# EAGLE design kicker_controller (EAGLE 9.6.2)
AUTHOR: Mike Schmidt; GENERATION: pasta; TITLE: Kicker Controller; VERSION: 04

## Sheet 1 of 2: Logic Circuitry
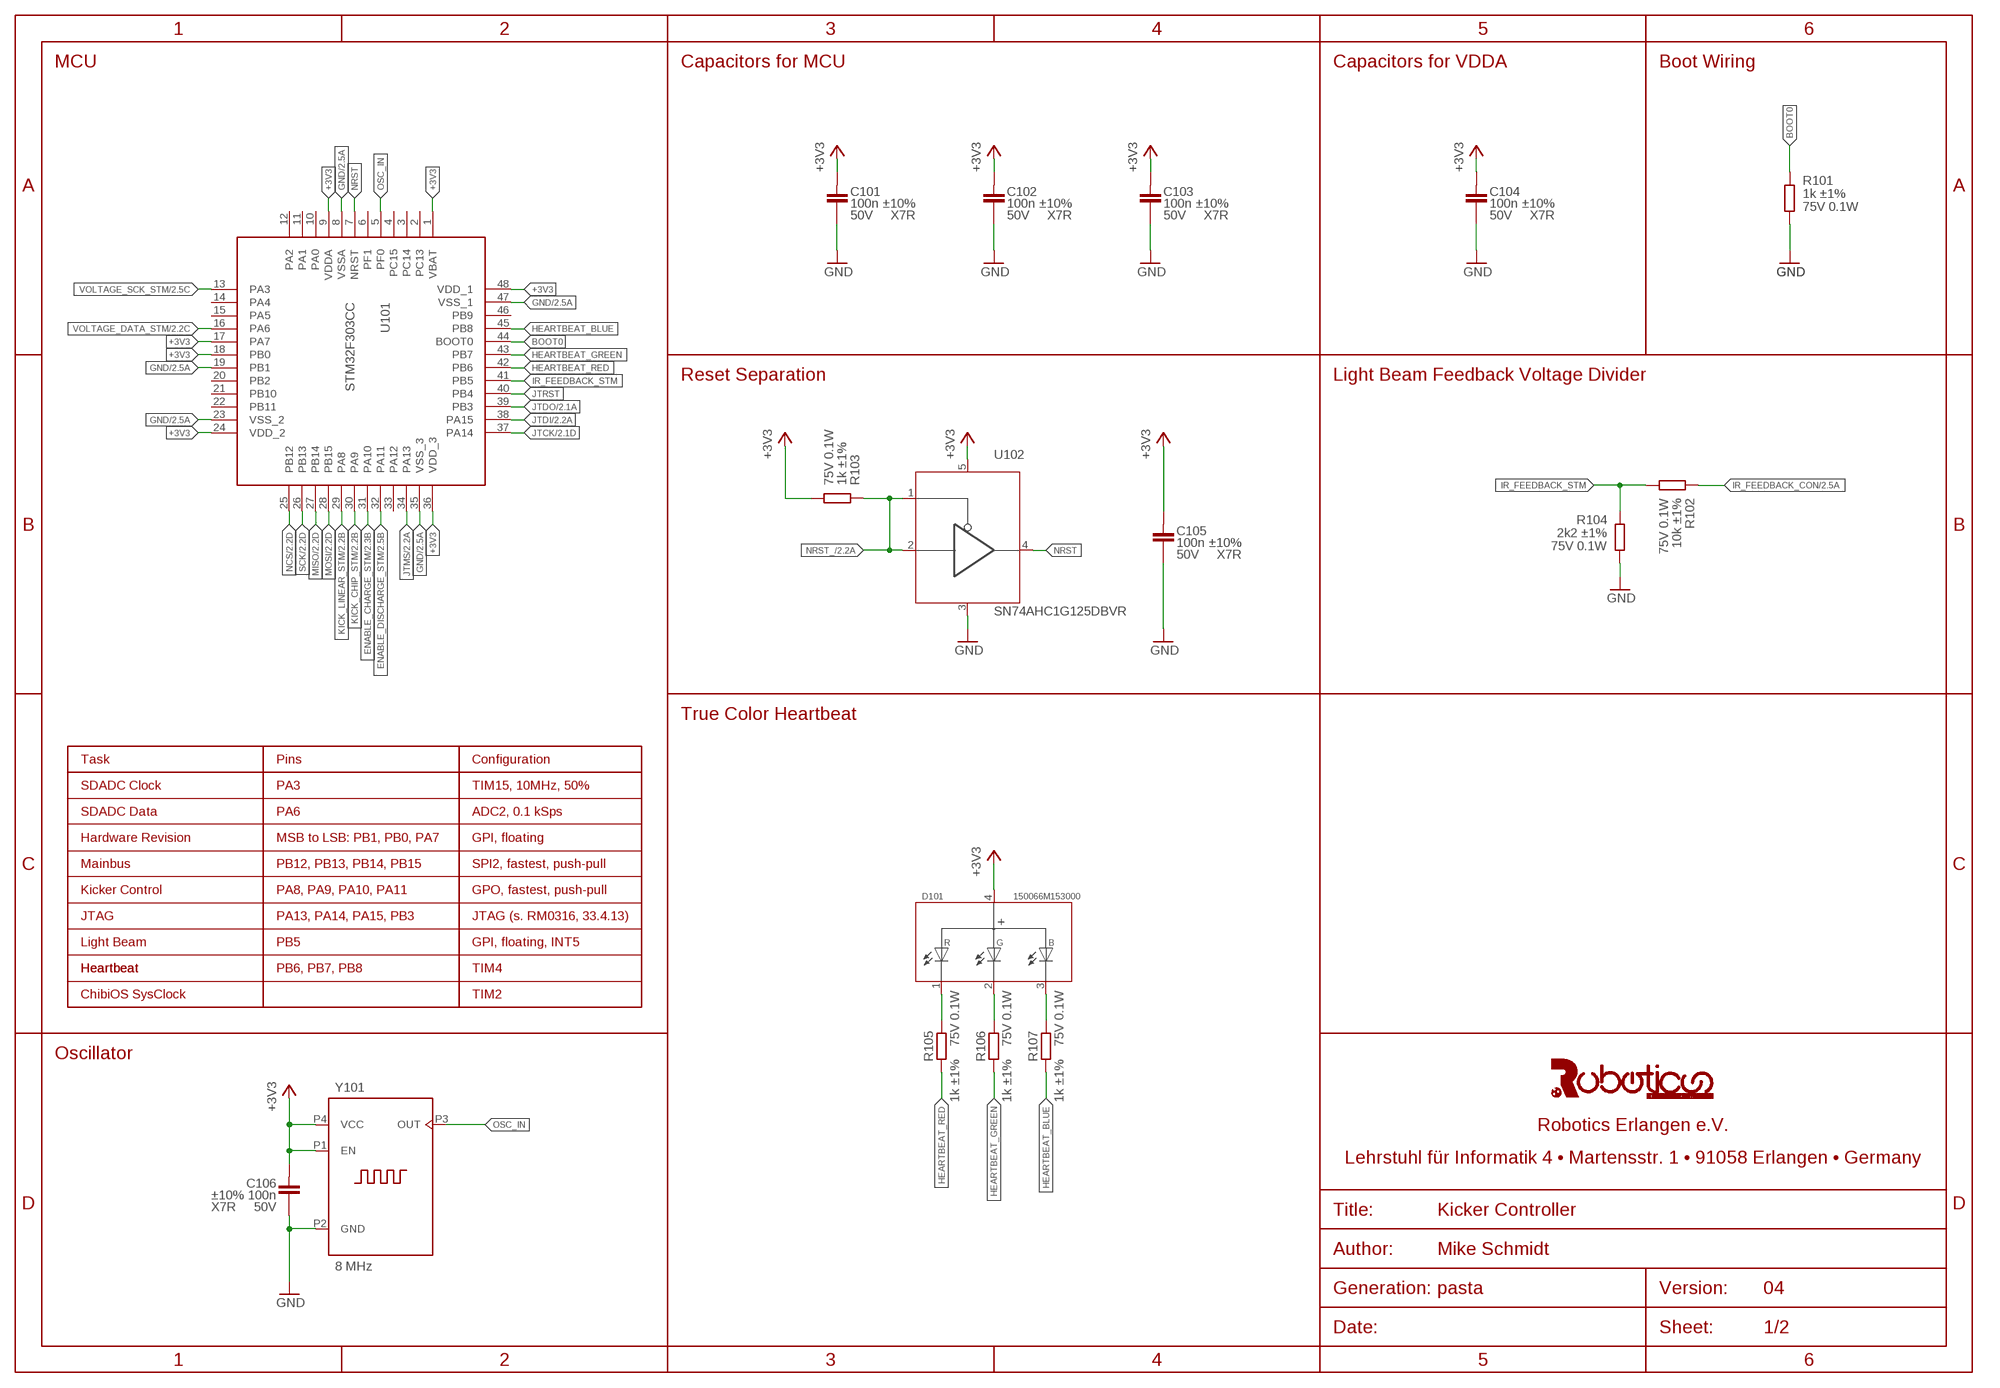
[diagram p0: schematic, sheet 1]

### Parts
C101  100n ±10% 50V X7R  C(100NF,50V,0603)  [C0603]
C102  100n ±10% 50V X7R  C(100NF,50V,0603)  [C0603]
C103  100n ±10% 50V X7R  C(100NF,50V,0603)  [C0603]
C104  100n ±10% 50V X7R  C(100NF,50V,0603)  [C0603]
C105  100n ±10% 50V X7R  C(100NF,50V,0603)  [C0603]
C106  100n ±10% 50V X7R  C(100NF,50V,0603)  [C0603]
D101  150066M153000  [WL-SFCX_0606]
R101  1k ±1% 75V 0.1W  R(1.0K,75V,0.1W,0603)  [R0603]
R102  10k ±1% 75V 0.1W  R(10K,75V,0.1W,0603)  [R0603]
R103  1k ±1% 75V 0.1W  R(1.0K,75V,0.1W,0603)  [R0603]
R104  2k2 ±1% 75V 0.1W  R(2.2K,75V,0.1W,0603)  [R0603]
R105  1k ±1% 75V 0.1W  R(1.0K,75V,0.1W,0603)  [R0603]
R106  1k ±1% 75V 0.1W  R(1.0K,75V,0.1W,0603)  [R0603]
R107  1k ±1% 75V 0.1W  R(1.0K,75V,0.1W,0603)  [R0603]
U101  STM32F303CC  [LQFP48]
U102  SN74AHC1G125DBVR  [SOT23-5]
Y101  8 MHz  830207192009  [830207192009]

### Nets
+3V3: C101.1 C102.1 C103.1 C104.1 C105.1 C106.1 D101.4 R103.1 U101.1(VBAT) U101.9(VDDA) U101.17(PA7) U101.18(PB0) U101.24(VDD_2) U101.36(VDD_3) U101.48(VDD_1) U102.5(VCC) Y101.P1(EN) Y101.P4(VCC) ; also sheet 2
BOOT0: R101.2 U101.44(BOOT0)
ENABLE_CHARGE_STM: U101.31(PA10) ; also sheet 2
ENABLE_DISCHARGE_STM: U101.32(PA11) ; also sheet 2
GND: C101.2 C102.2 C103.2 C104.2 C105.2 C106.2 R101.1 R104.1 U101.8(VSSA) U101.19(PB1) U101.23(VSS_2) U101.35(VSS_3) U101.47(VSS_1) U102.3(GND) Y101.P2(GND) ; also sheet 2
HEARTBEAT_BLUE: R107.2 U101.45(PB8)
HEARTBEAT_GREEN: R106.2 U101.43(PB7)
HEARTBEAT_RED: R105.2 U101.42(PB6)
IR_FEEDBACK_CON: R102.2 ; also sheet 2
IR_FEEDBACK_STM: R102.1 R104.2 U101.41(PB5)
JTCK: U101.37(PA14) ; also sheet 2
JTDI: U101.38(PA15) ; also sheet 2
JTDO: U101.39(PB3) ; also sheet 2
JTMS: U101.34(PA13) ; also sheet 2
JTRST: U101.40(PB4)
KICK_CHIP_STM: U101.30(PA9) ; also sheet 2
KICK_LINEAR_STM: U101.29(PA8) ; also sheet 2
MISO: U101.27(PB14) ; also sheet 2
MOSI: U101.28(PB15) ; also sheet 2
N$10: D101.1(R) R105.1
N$21: D101.2(G) R106.1
N$23: D101.3(B) R107.1
NCS: U101.25(PB12) ; also sheet 2
NRST: U101.7(NRST) U102.4(O)
NRST_: R103.2 U102.1(OE) U102.2(I) ; also sheet 2
OSC_IN: U101.5(PF0) Y101.P3(OUT)
SCK: U101.26(PB13) ; also sheet 2
VOLTAGE_DATA_STM: U101.16(PA6) ; also sheet 2
VOLTAGE_SCK_STM: U101.13(PA3) ; also sheet 2
Unconnected: U101.2(PC13) U101.3(PC14) U101.4(PC15) U101.6(PF1) U101.10(PA0) U101.11(PA1) U101.12(PA2) U101.14(PA4) U101.15(PA5) U101.20(PB2) U101.21(PB10) U101.22(PB11) U101.33(PA12) U101.46(PB9)

### Notes on the sheet
- MCU | Capacitors for MCU | Capacitors for VDDA | Boot Wiring
- Reset Separation | Light Beam Feedback Voltage Divider
- True Color Heartbeat
- Task | Pins | Configuration
- SDADC Clock | PA3 | TIM15, 10MHz, 50%
- SDADC Data | PA6 | ADC2, 0.1 kSps
- Hardware Revision | MSB to LSB: PB1, PB0, PA7 | GPI, floating
- Mainbus | PB12, PB13, PB14, PB15 | SPI2, fastest, push-pull
- Kicker Control | PA8, PA9, PA10, PA11 | GPO, fastest, push-pull
- JTAG | PA13, PA14, PA15, PB3 | JTAG (s. RM0316, 33.4.13)
- Light Beam | PB5 | GPI, floating, INT5
- Heartbeat | Heartbeat | PB6, PB7, PB8 | TIM4
- ChibiOS SysClock | TIM2
- Oscillator

## Sheet 2 of 2: Interface Circuitry
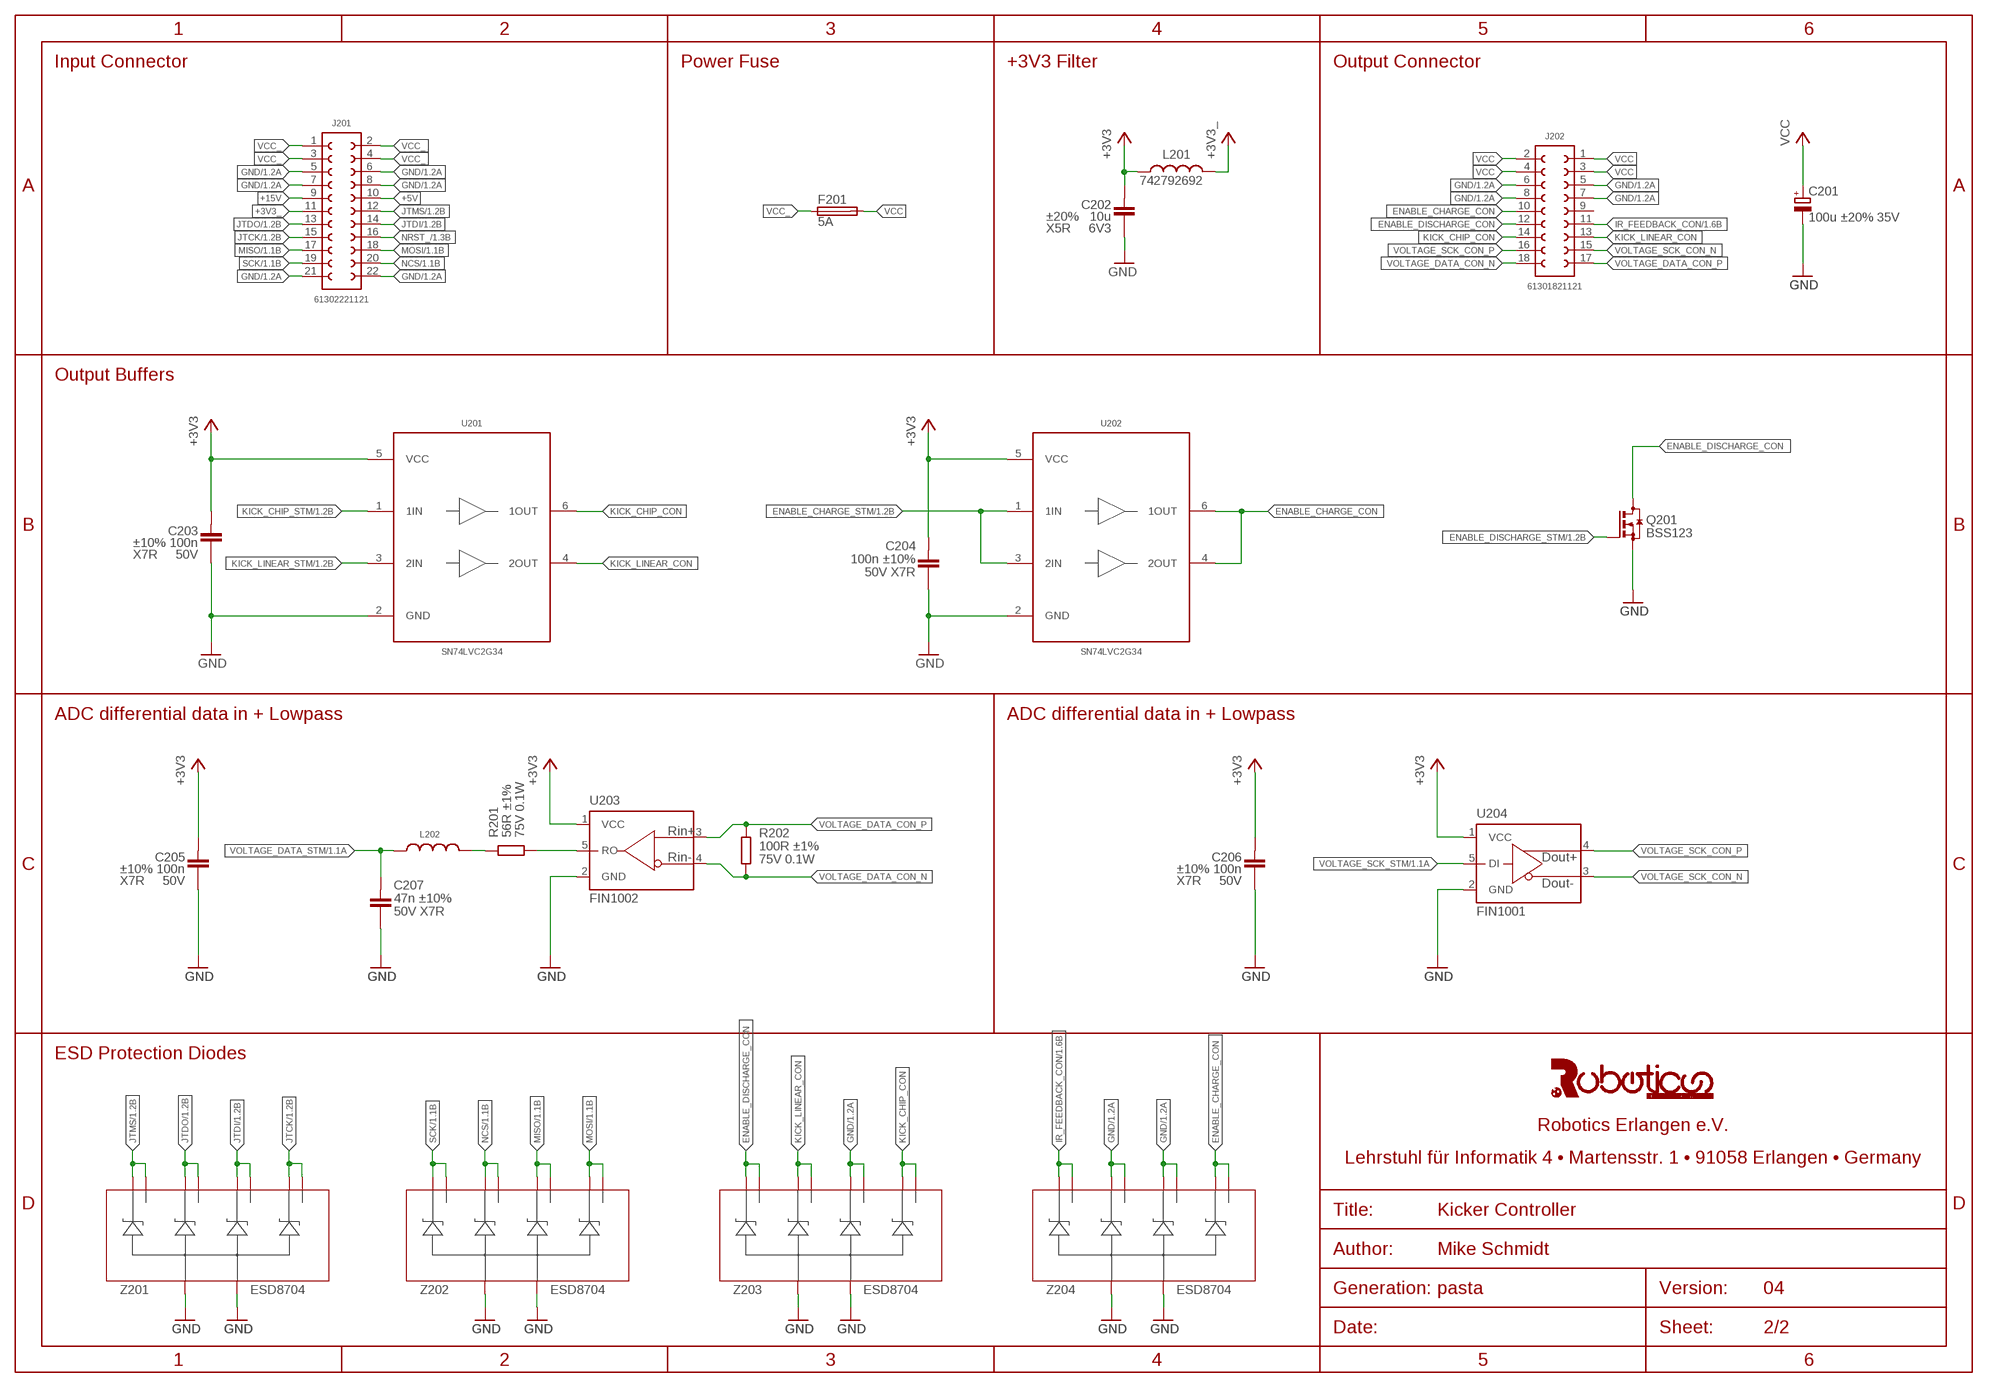
[diagram p1: schematic, sheet 2]

### Parts
C201  100u ±20% 35V  865080545012  [865080545012]
C202  10u ±20% 6V3 X5R  C(10UF,6.3V,0603)  [C0603]
C203  100n ±10% 50V X7R  C(100NF,50V,0603)  [C0603]
C204  100n ±10% 50V X7R  C(100NF,50V,0603)  [C0603]
C205  100n ±10% 50V X7R  C(100NF,50V,0603)  [C0603]
C206  100n ±10% 50V X7R  C(100NF,50V,0603)  [C0603]
C207  47n ±10% 50V X7R  C(47NF,50V,0603)  [C0603]
F201  5A  0157005.DRT  [157T]
J201  61302221121  [61302221121]
J202  61301821121  [61301821121]
L201  742792692  [WE-CBF_0603(W=2.6)]
L202  WE-GFH_4532_7447669212  [WE-GFH_4532]
Q201  BSS123  [SOT23]
R201  56R ±1% 75V 0.1W  R(56R,75V,0.1W,0603)  [R0603]
R202  100R ±1% 75V 0.1W  R(100R,75V,0.1W,0603)  [R0603]
U201  SN74LVC2G34  [SOT]
U202  SN74LVC2G34  [SOT]
U203  FIN1002  [SOT23-5]
U204  FIN1001  [SOT23-5]
Z201  ESD8704  [UDFN10]
Z202  ESD8704  [UDFN10]
Z203  ESD8704  [UDFN10]
Z204  ESD8704  [UDFN10]

### Nets
+3V3: C202.1 C203.1 C204.1 C205.1 C206.1 L201.2 U201.5(VCC) U202.5(VCC) U203.1(VCC) U204.1(VCC) ; also sheet 1
+3V3_: J201.11 L201.1
+5V: J201.10
+15V: J201.9
ENABLE_CHARGE_CON: J202.10 U202.4(2OUT) U202.6(1OUT) Z204.5(C4) Z204.6(D4)
ENABLE_CHARGE_STM: U202.1(1IN) U202.3(2IN) ; also sheet 1
ENABLE_DISCHARGE_CON: J202.12 Q201.3(D) Z203.1(C1) Z203.10(D1)
ENABLE_DISCHARGE_STM: Q201.1(G) ; also sheet 1
GND: C201.N(-) C202.2 C203.2 C204.2 C205.2 C206.2 C207.2 J201.5 J201.6 J201.7 J201.8 J201.21 J201.22 J202.5 J202.6 J202.7 J202.8 Q201.2(S) U201.2(GND) U202.2(GND) U203.2(GND) U204.2(GND) Z201.3(A) Z201.8(A) Z202.3(A) Z202.8(A) Z203.3(A) Z203.4(C3) Z203.7(D3) Z203.8(A) Z204.2(C2) Z204.3(A) Z204.4(C3) Z204.7(D3) Z204.8(A) Z204.9(D2) ; also sheet 1
IR_FEEDBACK_CON: J202.11 Z204.1(C1) Z204.10(D1) ; also sheet 1
JTCK: J201.15 Z201.5(C4) Z201.6(D4) ; also sheet 1
JTDI: J201.14 Z201.4(C3) Z201.7(D3) ; also sheet 1
JTDO: J201.13 Z201.2(C2) Z201.9(D2) ; also sheet 1
JTMS: J201.12 Z201.1(C1) Z201.10(D1) ; also sheet 1
KICK_CHIP_CON: J202.14 U201.6(1OUT) Z203.5(C4) Z203.6(D4)
KICK_CHIP_STM: U201.1(1IN) ; also sheet 1
KICK_LINEAR_CON: J202.13 U201.4(2OUT) Z203.2(C2) Z203.9(D2)
KICK_LINEAR_STM: U201.3(2IN) ; also sheet 1
MISO: J201.17 Z202.4(C3) Z202.7(D3) ; also sheet 1
MOSI: J201.18 Z202.5(C4) Z202.6(D4) ; also sheet 1
N$1: R201.1 U203.5(RO)
N$2: L202.2 R201.2
NCS: J201.20 Z202.2(C2) Z202.9(D2) ; also sheet 1
NRST_: J201.16 ; also sheet 1
SCK: J201.19 Z202.1(C1) Z202.10(D1) ; also sheet 1
VCC: C201.P(+) F201.2 J202.1 J202.2 J202.3 J202.4
VCC_: F201.1 J201.1 J201.2 J201.3 J201.4
VOLTAGE_DATA_CON_N: J202.18 R202.1 U203.4(RIN-)
VOLTAGE_DATA_CON_P: J202.17 R202.2 U203.3(RIN+)
VOLTAGE_DATA_STM: C207.1 L202.1 ; also sheet 1
VOLTAGE_SCK_CON_N: J202.15 U204.3(DOUT-)
VOLTAGE_SCK_CON_P: J202.16 U204.4(DOUT+)
VOLTAGE_SCK_STM: U204.5(DI) ; also sheet 1
Unconnected: J202.9

### Notes on the sheet
- Input Connector | Power Fuse | +3V3 Filter | Output Connector
- Output Buffers
- ADC differential data in + Lowpass | ADC differential data in + Lowpass
- ESD Protection Diodes

## Library data of the parts
C101-C106 C203-C206 = capacitors:C(*?): Robotics Erlangen Capacitor Library This library provides a list of predefined capacitors with the following features: It is guaranteed that the capacitor exists with the given value, voltage rating and package size If you choose the capacitor you need (e.g. 2u2 with at least 50V) the package will be automatically choosen The manufacturer's data is automatically added so that exactly that capacitor will be ordered The value of the capacitor will be automatically filled with the most relevant data To choose a capacitor, you need to think about the voltage it must be rated for acc. to your application. Use below table to get a minimum voltage rating for the capacitor, depending on the maximum voltage that will be applied to it in your application. Maximum Voltage Applied Notes Minimum Voltage Rating ≤ 3.3V ≥ 6V3 ≤ 5.0V ≥ 10V ≤ 16.8V ≥ 25V ≤ 33.6V Includes all signals that are at max. VCC ≥ 50V After you determined the minimum voltage rating of the capacitor, search for it in the database of this library and choose the first one, that has at least that rating. The library is primarily sorted by capacitance values. Never change the value of predefined capacitors! Note: If your project requires a very specific capacitor (e.g. low tolerance, high voltage or E-24 upwards), then choose any of the predefined empty devices C(0402), C(0603), C(0805), C(1206), C(1210), or C(1812). Always set the attributes MF, MPN and VALUE for custom capacitors!; CAPACITANCE: 100n; DIELECTRIC: X7R; LINE1: 100n ±10%; LINE2: 50V X7R; MF: Würth Elektronik; MPN: 885012206095; TOLERANCE: ±10%; VOLTAGE: 50V
C201 = kicker_controller:865080545012; MF: Würth Elektronik; MPN: 865080545012
C202 = capacitors:C(*?): Robotics Erlangen Capacitor Library This library provides a list of predefined capacitors with the following features: It is guaranteed that the capacitor exists with the given value, voltage rating and package size If you choose the capacitor you need (e.g. 2u2 with at least 50V) the package will be automatically choosen The manufacturer's data is automatically added so that exactly that capacitor will be ordered The value of the capacitor will be automatically filled with the most relevant data To choose a capacitor, you need to think about the voltage it must be rated for acc. to your application. Use below table to get a minimum voltage rating for the capacitor, depending on the maximum voltage that will be applied to it in your application. Maximum Voltage Applied Notes Minimum Voltage Rating ≤ 3.3V ≥ 6V3 ≤ 5.0V ≥ 10V ≤ 16.8V ≥ 25V ≤ 33.6V Includes all signals that are at max. VCC ≥ 50V After you determined the minimum voltage rating of the capacitor, search for it in the database of this library and choose the first one, that has at least that rating. The library is primarily sorted by capacitance values. Never change the value of predefined capacitors! Note: If your project requires a very specific capacitor (e.g. low tolerance, high voltage or E-24 upwards), then choose any of the predefined empty devices C(0402), C(0603), C(0805), C(1206), C(1210), or C(1812). Always set the attributes MF, MPN and VALUE for custom capacitors!; CAPACITANCE: 10u; DIELECTRIC: X5R; LINE1: 10u ±20%; LINE2: 6V3 X5R; MF: Würth Elektronik; MPN: 885012106006; TOLERANCE: ±20%; VOLTAGE: 6V3
C207 = capacitors:C(*?): Robotics Erlangen Capacitor Library This library provides a list of predefined capacitors with the following features: It is guaranteed that the capacitor exists with the given value, voltage rating and package size If you choose the capacitor you need (e.g. 2u2 with at least 50V) the package will be automatically choosen The manufacturer's data is automatically added so that exactly that capacitor will be ordered The value of the capacitor will be automatically filled with the most relevant data To choose a capacitor, you need to think about the voltage it must be rated for acc. to your application. Use below table to get a minimum voltage rating for the capacitor, depending on the maximum voltage that will be applied to it in your application. Maximum Voltage Applied Notes Minimum Voltage Rating ≤ 3.3V ≥ 6V3 ≤ 5.0V ≥ 10V ≤ 16.8V ≥ 25V ≤ 33.6V Includes all signals that are at max. VCC ≥ 50V After you determined the minimum voltage rating of the capacitor, search for it in the database of this library and choose the first one, that has at least that rating. The library is primarily sorted by capacitance values. Never change the value of predefined capacitors! Note: If your project requires a very specific capacitor (e.g. low tolerance, high voltage or E-24 upwards), then choose any of the predefined empty devices C(0402), C(0603), C(0805), C(1206), C(1210), or C(1812). Always set the attributes MF, MPN and VALUE for custom capacitors!; CAPACITANCE: 47n; DIELECTRIC: X7R; LINE1: 47n ±10%; LINE2: 50V X7R; MF: Würth Elektronik; MPN: 885012206093; TOLERANCE: ±10%; VOLTAGE: 50V
D101 = kicker_controller:150066M153000: WL-SFCD SMD Full-color Chip LED Diffused <http://katalog.we-online.de/media/images/v2/Family_WL-SFCD.jpg> Details see: http://katalog.we-online.de/en/led/WL-SFCD Created By Yingchun,Shan 2016 (C) Wurth Elektronik; MF: Würth Elektronik; MPN: 150066M153000
F201 = kicker_controller:0157*DRT: 157T Series - Standard Nano2® Fuse and Clip Assembly Description The 157T Series Fuse/Clip assembly is a small, square, Time-Lag, surface mount fuse that is assembled in surface mountable fuse clips. The unique time delay feature of this fuse design helps solve the problem of nuisance “opening” by accommodating inrush currents that normally cause a fast acting fuse to open. The fuse clip and pre-installed fuse combination can be automatically placed in PC Board in one efficient manufacturing operation. It permits quick and easy replacement of fuses without performing desoldering process, even in the field and without exposing the PC Board to detrimental effects of rework solder heat. Features Surface-Mountable, Time-Lag Fuse. Fully compatible with RoHS/Pb-Free solder alloys and higher temperature profiles associated with leadfree assembly Easily replaceable on PC Board (Field Replaceable) RoHS Compliant and Halogen-free Available in ratings of 0.375 ~ 5 Amperes Applications Instrumentations Base Stations Telecommunications Additional Information Datasheet <http://www.littelfuse.com/~/media/electronics/datasheets/fuses/littelfuse_fuse_157t_datasheet.pdf.pdf> Resources <http://www.littelfuse.com/products/fuse-blocks-fuseholders-and-fuse-accessories/fuse-clips/157t.aspx#TechnicalResources> Samples <http://www.littelfuse.com/products/fuse-blocks-fuseholders-and-fuse-accessories/fuse-clips/157t.aspx#ElectricalCharacteristics>; MF: Littelfuse; MOUSER: 576-0157005.DRT; MPN: 0157005.DRT
J201 = connectors:61302221121; MF: Würth Elektronik; MPN: 61302221121
J202 = connectors:61301821121; MF: Würth Elektronik; MPN: 61301821121
L201 = kicker_controller:742792: WE-CBF SMD EMI Suppression Ferrite Bead Characteristics Reliable Ni-Sn electrodes High rated current up to 6 A Operating temperature: –55 ºC to +125 ºC Applications Perfect as data lined filter and for uncoupling of distribution voltage Package name and Variant abbreviation: Package: Wide Band /High Speed: W=Width= 2.2 High Current: W=Width= 2.6 Variant abbreviation: WB = Wide Band HS=High Speed HC=High Current <https://katalog.we-online.de/media/images/v2/o14753v209%20Family_WE-CBF.jpg> Details see: http://katalog.we-online.de/en/pbs/WE-CBF Updated by Ella Wu 2019-01-02 2019 (C) Wurth Elektronik; MF: Würth Elektronik; MPN: 742792692
L202 = kicker_controller:WE-GFH_4532: SMD RF Choke WE-GFH - Wire wound ferrite - For higher currents -- HF-circuits like tuner, transponder etc. <http://katalog.we-online.de/media/images/v2/Family_WE-GFH.jpg> Details see: http://katalog.we-online.de/en/pbs/WE-GFH Updated by Dan Xu 2014-05-19 2014 (C) Wurth Elektronik; WE-NUMBER: 7447669212/120uH
Q201 = kicker_controller:BSS123: N-CHANNEL MOS FET
R101 R103 R105-R107 = resistors:R(*?): Robotics Erlangen Resistor Library This library provides a list of predefined resistors with the following features: It is guaranteed that the resistor exists with the given value, voltage rating and package size If you choose the resistor you need (e.g. 10k with at least 75V and 0.1W) the package will be automatically choosen The manufacturer's data is automatically added so that exactly that resistor will be ordered The value of the resistor will be automatically filled with the most relevant data To choose a resistor, you have to determine the maximum operating voltage and power dissipation that will be applied to that resistor in your design. With these two values you can choose the minimum package acc. to below table, which lists the maximum operating voltage and power dissipation for each package. Always try to use a package with a voltage rating of at least twice your max. operating voltage and always keep a little marging between your power dissipation and the maximum power dissipation of the package (although typically, resistors can be overloaded by a factor of five for a short time period, i.e. less than a second). Package Maximum Operating Voltage Maximum Power Dissipation 0402 ≤ 50V ≤ 62.5 mW 0603 ≤ 75V ≤ 100 mW 0805 ≤ 150V ≤ 125 mW 1206 ≤ 200V ≤ 250 mW 1210 ≤ 200V ≤ 500 mW 2512 ≤ 200V ≤ 1 W Note: If your project requires a very specific resistor (e.g. low tolerance, high voltage / power dissipation or E-24 upwards), then choose any of the predefined empty devices R(0402), R(0603), R(0805), R(1206), R(1210), or R(2512). Always set the attributes MF, MPN and VALUE for custom resistors! Never change the value of non-custom resistors!; LINE1: 1k ±1%; LINE2: 75V 0.1W; MF: YAGEO; MPN: RC0603FR-071KL; POWER: 0.1W; RESISTANCE: 1k; TOLERANCE: ±1%; VOLTAGE: 75V
R102 = resistors:R(*?): Robotics Erlangen Resistor Library This library provides a list of predefined resistors with the following features: It is guaranteed that the resistor exists with the given value, voltage rating and package size If you choose the resistor you need (e.g. 10k with at least 75V and 0.1W) the package will be automatically choosen The manufacturer's data is automatically added so that exactly that resistor will be ordered The value of the resistor will be automatically filled with the most relevant data To choose a resistor, you have to determine the maximum operating voltage and power dissipation that will be applied to that resistor in your design. With these two values you can choose the minimum package acc. to below table, which lists the maximum operating voltage and power dissipation for each package. Always try to use a package with a voltage rating of at least twice your max. operating voltage and always keep a little marging between your power dissipation and the maximum power dissipation of the package (although typically, resistors can be overloaded by a factor of five for a short time period, i.e. less than a second). Package Maximum Operating Voltage Maximum Power Dissipation 0402 ≤ 50V ≤ 62.5 mW 0603 ≤ 75V ≤ 100 mW 0805 ≤ 150V ≤ 125 mW 1206 ≤ 200V ≤ 250 mW 1210 ≤ 200V ≤ 500 mW 2512 ≤ 200V ≤ 1 W Note: If your project requires a very specific resistor (e.g. low tolerance, high voltage / power dissipation or E-24 upwards), then choose any of the predefined empty devices R(0402), R(0603), R(0805), R(1206), R(1210), or R(2512). Always set the attributes MF, MPN and VALUE for custom resistors! Never change the value of non-custom resistors!; LINE1: 10k ±1%; LINE2: 75V 0.1W; MF: YAGEO; MPN: RC0603FR-0710KL; POWER: 0.1W; RESISTANCE: 10k; TOLERANCE: ±1%; VOLTAGE: 75V
R104 = resistors:R(*?): Robotics Erlangen Resistor Library This library provides a list of predefined resistors with the following features: It is guaranteed that the resistor exists with the given value, voltage rating and package size If you choose the resistor you need (e.g. 10k with at least 75V and 0.1W) the package will be automatically choosen The manufacturer's data is automatically added so that exactly that resistor will be ordered The value of the resistor will be automatically filled with the most relevant data To choose a resistor, you have to determine the maximum operating voltage and power dissipation that will be applied to that resistor in your design. With these two values you can choose the minimum package acc. to below table, which lists the maximum operating voltage and power dissipation for each package. Always try to use a package with a voltage rating of at least twice your max. operating voltage and always keep a little marging between your power dissipation and the maximum power dissipation of the package (although typically, resistors can be overloaded by a factor of five for a short time period, i.e. less than a second). Package Maximum Operating Voltage Maximum Power Dissipation 0402 ≤ 50V ≤ 62.5 mW 0603 ≤ 75V ≤ 100 mW 0805 ≤ 150V ≤ 125 mW 1206 ≤ 200V ≤ 250 mW 1210 ≤ 200V ≤ 500 mW 2512 ≤ 200V ≤ 1 W Note: If your project requires a very specific resistor (e.g. low tolerance, high voltage / power dissipation or E-24 upwards), then choose any of the predefined empty devices R(0402), R(0603), R(0805), R(1206), R(1210), or R(2512). Always set the attributes MF, MPN and VALUE for custom resistors! Never change the value of non-custom resistors!; LINE1: 2k2 ±1%; LINE2: 75V 0.1W; MF: YAGEO; MPN: RC0603FR-072K2L; POWER: 0.1W; RESISTANCE: 2k2; TOLERANCE: ±1%; VOLTAGE: 75V
R201 = resistors:R(*?): Robotics Erlangen Resistor Library This library provides a list of predefined resistors with the following features: It is guaranteed that the resistor exists with the given value, voltage rating and package size If you choose the resistor you need (e.g. 10k with at least 75V and 0.1W) the package will be automatically choosen The manufacturer's data is automatically added so that exactly that resistor will be ordered The value of the resistor will be automatically filled with the most relevant data To choose a resistor, you have to determine the maximum operating voltage and power dissipation that will be applied to that resistor in your design. With these two values you can choose the minimum package acc. to below table, which lists the maximum operating voltage and power dissipation for each package. Always try to use a package with a voltage rating of at least twice your max. operating voltage and always keep a little marging between your power dissipation and the maximum power dissipation of the package (although typically, resistors can be overloaded by a factor of five for a short time period, i.e. less than a second). Package Maximum Operating Voltage Maximum Power Dissipation 0402 ≤ 50V ≤ 62.5 mW 0603 ≤ 75V ≤ 100 mW 0805 ≤ 150V ≤ 125 mW 1206 ≤ 200V ≤ 250 mW 1210 ≤ 200V ≤ 500 mW 2512 ≤ 200V ≤ 1 W Note: If your project requires a very specific resistor (e.g. low tolerance, high voltage / power dissipation or E-24 upwards), then choose any of the predefined empty devices R(0402), R(0603), R(0805), R(1206), R(1210), or R(2512). Always set the attributes MF, MPN and VALUE for custom resistors! Never change the value of non-custom resistors!; LINE1: 56R ±1%; LINE2: 75V 0.1W; MF: YAGEO; MPN: RC0603FR-0756RL; POWER: 0.1W; RESISTANCE: 56R; TOLERANCE: ±1%; VOLTAGE: 75V
R202 = resistors:R(*?): Robotics Erlangen Resistor Library This library provides a list of predefined resistors with the following features: It is guaranteed that the resistor exists with the given value, voltage rating and package size If you choose the resistor you need (e.g. 10k with at least 75V and 0.1W) the package will be automatically choosen The manufacturer's data is automatically added so that exactly that resistor will be ordered The value of the resistor will be automatically filled with the most relevant data To choose a resistor, you have to determine the maximum operating voltage and power dissipation that will be applied to that resistor in your design. With these two values you can choose the minimum package acc. to below table, which lists the maximum operating voltage and power dissipation for each package. Always try to use a package with a voltage rating of at least twice your max. operating voltage and always keep a little marging between your power dissipation and the maximum power dissipation of the package (although typically, resistors can be overloaded by a factor of five for a short time period, i.e. less than a second). Package Maximum Operating Voltage Maximum Power Dissipation 0402 ≤ 50V ≤ 62.5 mW 0603 ≤ 75V ≤ 100 mW 0805 ≤ 150V ≤ 125 mW 1206 ≤ 200V ≤ 250 mW 1210 ≤ 200V ≤ 500 mW 2512 ≤ 200V ≤ 1 W Note: If your project requires a very specific resistor (e.g. low tolerance, high voltage / power dissipation or E-24 upwards), then choose any of the predefined empty devices R(0402), R(0603), R(0805), R(1206), R(1210), or R(2512). Always set the attributes MF, MPN and VALUE for custom resistors! Never change the value of non-custom resistors!; LINE1: 100R ±1%; LINE2: 75V 0.1W; MF: YAGEO; MPN: RC0603FR-07100RL; POWER: 0.1W; RESISTANCE: 100R; TOLERANCE: ±1%; VOLTAGE: 75V
U101 = kicker_controller:STM32F303CC: Cortex M4 Microcontroller; MF: STMicroelectronics; MOUSER: 511-STM32F303CCT6; MPN: STM32F303CCT6
U102 = kicker_controller:SN74AHC1G125DBV; MF: Texas Instruments; MOUSER: 595-SN74AHC1G125DBVR; MPN: SN74AHC1G125DBVR
U201 U202 = kicker_controller:SN74LVC2G34: 1. Features: Available in the Texas Instruments NanoFreeTM Package Supports 5.5 V VCC Operation Inputs Accept Voltages to 5.5 V Maximum tpd of 4.1 ns at 3.3 V Low Power Consumption, 10 µA Maximum ICC ±24 mA Output Drive at 3.3 V Typical VOLP (Output Ground Bounce) <0.8 V at VCC = 3.3 V, TA = 25 °C Typical VOHV (Output VOH Undershoot) >2 V at VCC = 3.3 V, TA = 25 °C Ioff Supports Live Insertion, Partial-Power-Down Mode, and Back-Drive Protection Can Be Used as a Down Translator to Translate Inputs From a Maximum of 5.5 V Down to the VCC Level Latch-Up Performance Exceeds 100 mA Per JESD 78, Class II ESD Protection Exceeds JESD 22 2000 V Human Body Model (A114-A) 200 V Machine Model (A115-A) 1000 V Charged-Device Model (C101) 2. Applications AV Receivers Audio Docks: Portable Blu-ray Players and Home Theaters DVD Recorders and Players Embedded PCs MP3 Players and Recorders (Portable Audio) Personal Digital Assistent (PDA) Power: Telecom/Server AC/DC Supply: Single Controller: Analog and Digital Solid-State Drive (SSD): Client and Enterprise TV: LCD/Digital and High-Definition (HDTV) Tablets: Enterprise Video Analytics: Servers Wireless Headsets, Keyboards, and Mice 3. Description The SN74LVC2G34 device is a dual buffer gate designed for 1.65 V to 5.5 V VCC operation. The SN74LVC2G34 device performs the Boolean function Y = A in positive logic. NanoFree package technology is a major breakthrough in IC packaging concepts, using the die as the package. This device is fully specified for partial-power-down applications using Ioff. The Ioff circuitry disables the outputs, preventing damaging current backflow through the device when it is powered down.; MF: Texas Instruments; MOUSER: 595-SN74LVC2G34DRLR; MPN: SN74LVC2G34
U203 = kicker_controller:FIN1002: 3.3V LVDS 1-Bit High Speed Differential Receiver; MOUSER-NR: 512-FIN1002M5X
U204 = kicker_controller:FIN1001: 3.3V LVDS 1-Bit High Speed Differential Driver; MOUSER-NR: 512-FIN1001M5X
Y101 = kicker_controller:83020*09; MF: Würth Elektronik; MPN: 830207192009
Z201-Z204 = kicker_controller:ESD8704; MF: ON Semiconductor; MOUSER: 863-ESD8704MUTAG; MPN: ESD8704MUTAG

## Net classes
0 default: clearance 0.2 mm

## Board
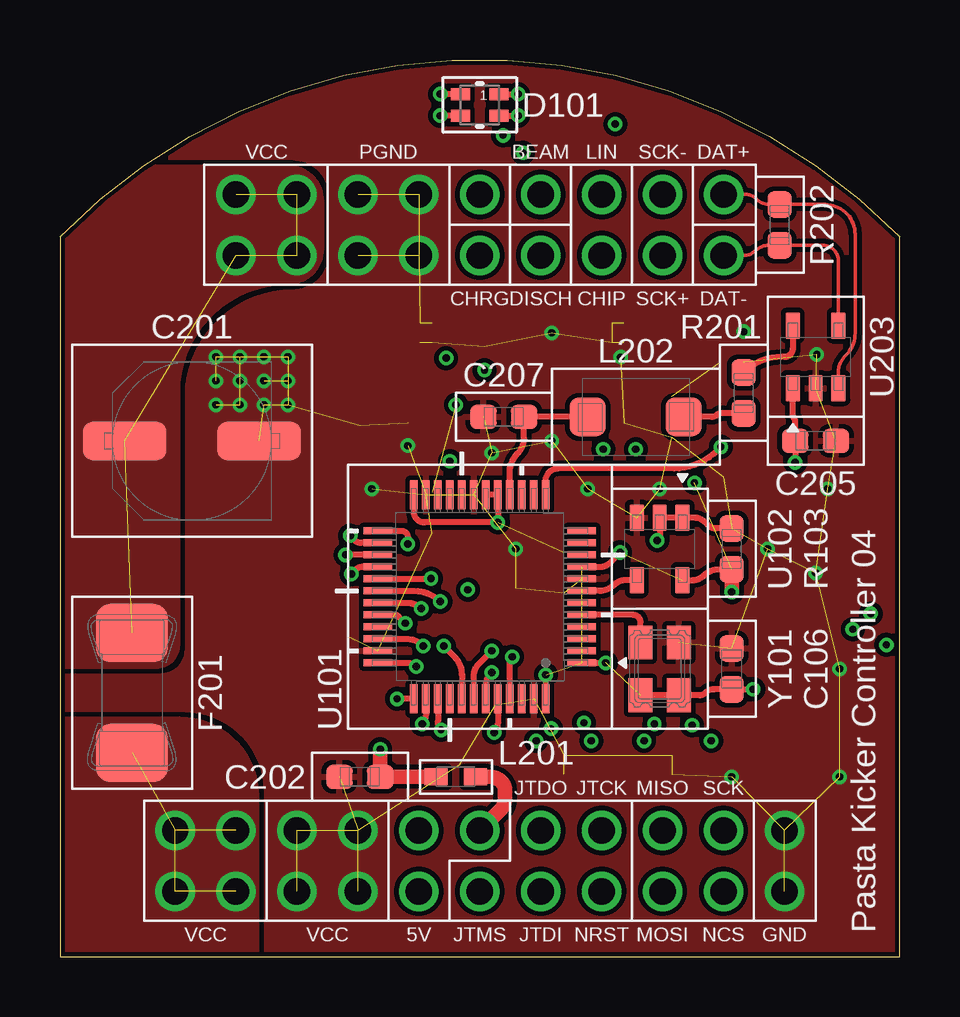
[diagram p2: board, top side]
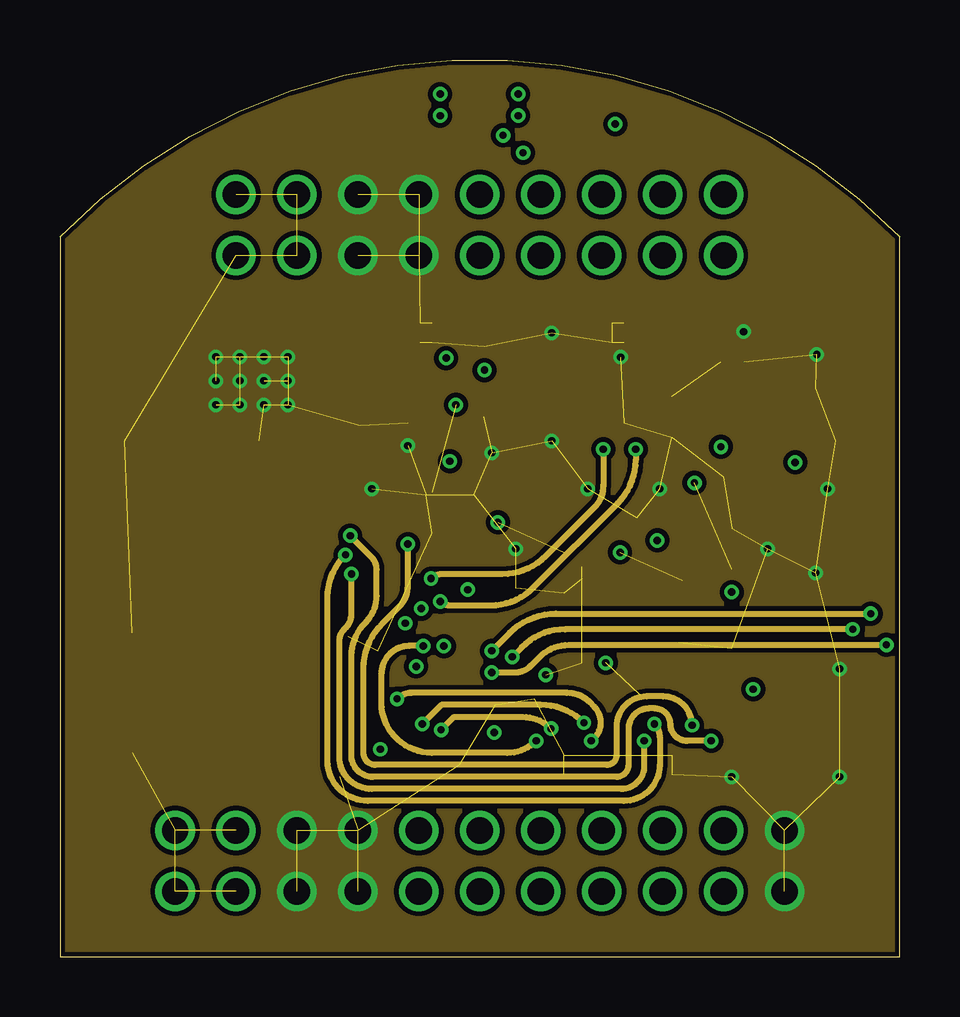
[diagram p3: board, inner layer Route2]
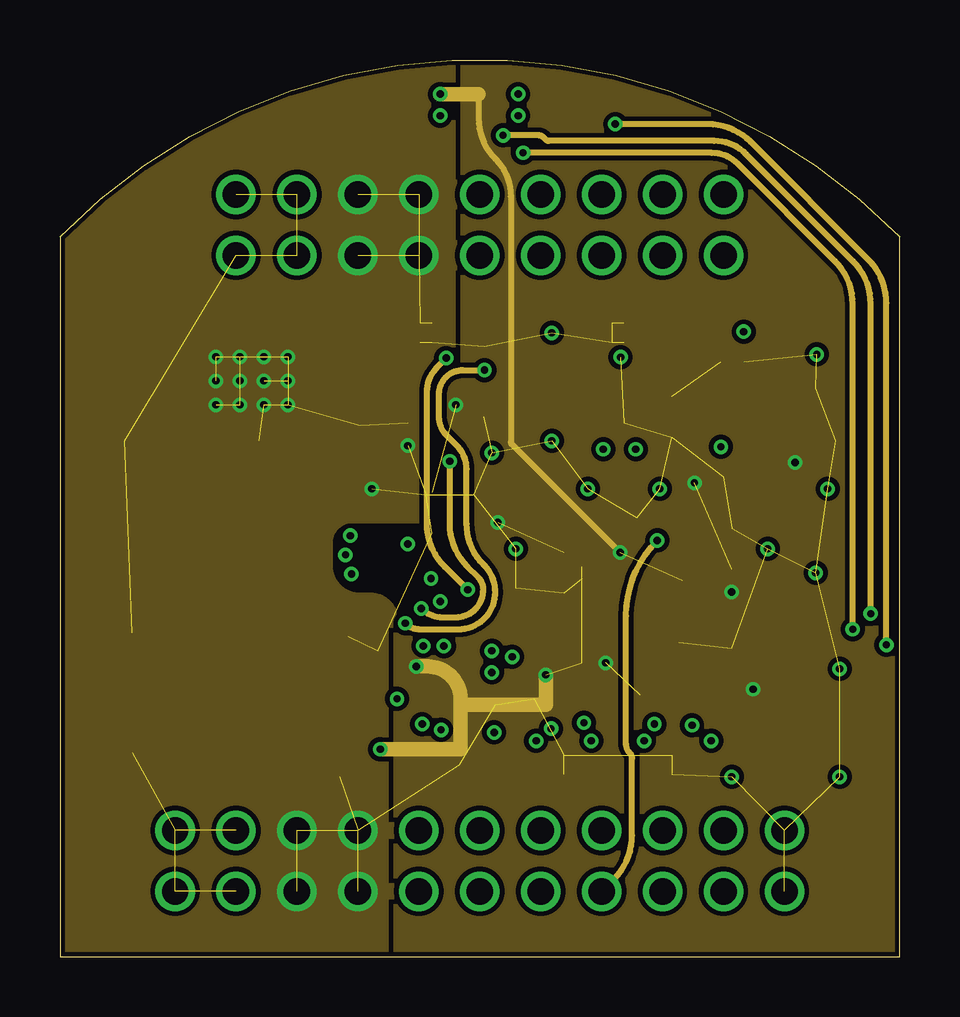
[diagram p4: board, inner layer Route15]
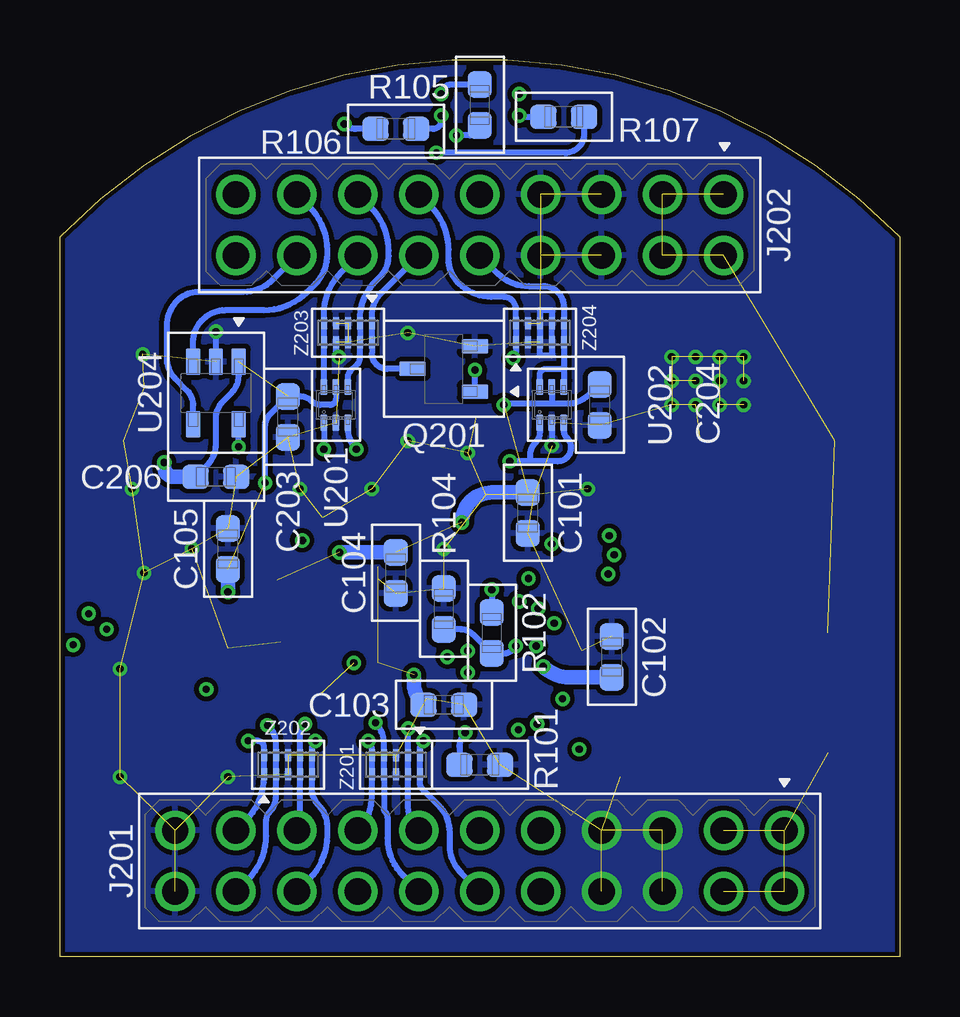
[diagram p5: board, bottom side, seen from below]

Size 35 x 37.37 mm. Coordinates in mm from the lower left corner, seen from the top.
Outline: 0,0 35,0 35,30 arc92 0,30 0,0
Copper layers (1+2*15+16): Top 0.035mm / dielectric 0.175mm / Route2 0.035mm / dielectric 1.13mm / Route15 0.035mm / dielectric 0.175mm / Bottom 0.035mm
Design rules "35u Robotics DRU No. 3 (6mil, 4 Layer, 0.3mm Drill)": minimum track width 6mil, minimum drill 0.3mm, track to track 6mil, track to pad 6mil, pad to pad 6mil, via to via 6mil, smd to smd 0mil, copper to edge 0.2mm, drill to drill 6mil, minimum pad ring 0.15mm, minimum via ring 0.15mm, stop-mask expansion 0.05mm, vias tented up to drill 0.45mm, thermal gap 0.2mm

### Footprints (pad centres in the part's own frame; a part is rotated, then mirrored left to right if it is on the bottom)
C0603 = smd 1.1 x 1: 1 -0.85,0; 2 0.85,0
865080545012 = smd 1.6 x 3.5: N 0,2.8; P 0,-2.8
WL-SFCX_0606 = smd 0.8 x 0.5: 1 0.8,0.45; 2 0.8,-0.45; 3 -0.8,-0.45; 4 -0.8,0.45
157T = smd 2.4 x 3: 1 -2.5,0; 2 2.5,0
61302221121 = drill 1.1: 1 -12.7,-1.27; 2 -12.7,1.27; 3 -10.16,-1.27; 4 -10.16,1.27; 5 -7.62,-1.27; 6 -7.62,1.27; 7 -5.08,-1.27; 8 -5.08,1.27; 9 -2.54,-1.27; 10 -2.54,1.27; 11 0,-1.27; 12 0,1.27; 13 2.54,-1.27; 14 2.54,1.27; 15 5.08,-1.27; 16 5.08,1.27; 17 7.62,-1.27; 18 7.62,1.27; 19 10.16,-1.27; 20 10.16,1.27; 21 12.7,-1.27; 22 12.7,1.27
61301821121 = drill 1.1: 1 -10.16,-1.27; 2 -10.16,1.27; 3 -7.62,-1.27; 4 -7.62,1.27; 5 -5.08,-1.27; 6 -5.08,1.27; 7 -2.54,-1.27; 8 -2.54,1.27; 9 0,-1.27; 10 0,1.27; 11 2.54,-1.27; 12 2.54,1.27; 13 5.08,-1.27; 14 5.08,1.27; 15 7.62,-1.27; 16 7.62,1.27; 17 10.16,-1.27; 18 10.16,1.27
WE-CBF_0603(W=2.6) = smd 0.95 x 0.7: 1 -0.825,0; 2 0.825,0
WE-GFH_4532 = smd 1.5 x 1.6: 1 -2,0; 2 2,0
SOT23 = smd 0.6 x 1.1: 1 -0.95,-1.3; 2 0.95,-1.3; 3 0,1.3
R0603 = smd 1.1 x 1: 1 -0.85,0; 2 0.85,0
LQFP48 = smd 1.2 x 0.3: 1 -4.25,2.75; 2 -4.25,2.25; 3 -4.25,1.75; 4 -4.25,1.25; 5 -4.25,0.75; 6 -4.25,0.25; 7 -4.25,-0.25; 8 -4.25,-0.75; 9 -4.25,-1.25; 10 -4.25,-1.75; 11 -4.25,-2.25; 12 -4.25,-2.75; 25 4.25,-2.75; 26 4.25,-2.25; 27 4.25,-1.75; 28 4.25,-1.25; 29 4.25,-0.75; 30 4.25,-0.25; 31 4.25,0.25; 32 4.25,0.75; 33 4.25,1.25; 34 4.25,1.75; 35 4.25,2.25; 36 4.25,2.75 | smd 0.3 x 1.2: 13 -2.75,-4.25; 14 -2.25,-4.25; 15 -1.75,-4.25; 16 -1.25,-4.25; 17 -0.75,-4.25; 18 -0.25,-4.25; 19 0.25,-4.25; 20 0.75,-4.25; 21 1.25,-4.25; 22 1.75,-4.25; 23 2.25,-4.25; 24 2.75,-4.25; 37 2.75,4.25; 38 2.25,4.25; 39 1.75,4.25; 40 1.25,4.25; 41 0.75,4.25; 42 0.25,4.25; 43 -0.25,4.25; 44 -0.75,4.25; 45 -1.25,4.25; 46 -1.75,4.25; 47 -2.25,4.25; 48 -2.75,4.25
SOT23-5 = smd 1.1 x 0.6: 1 -1.3,0.95; 2 -1.3,0; 3 -1.3,-0.95; 4 1.3,-0.95; 5 1.3,0.95
SOT = smd 0.67 x 0.3: 1 -0.74,0.5; 2 -0.74,0; 3 -0.74,-0.5; 4 0.74,-0.5; 5 0.74,0; 6 0.74,0.5
830207192009 = smd 1.4 x 1: P1 -1.1,-0.8; P2 1.1,-0.8; P3 1.1,0.8; P4 -1.1,0.8
UDFN10 = smd 0.25 x 0.5: 1 1,0.4; 2 0.5,0.4; 3 0,0.4; 4 -0.5,0.4; 5 -1,0.4; 6 -1,-0.4; 7 -0.5,-0.4; 8 0,-0.4; 9 0.5,-0.4; 10 1,-0.4

### Placement (x,y rotation side)
C101  15.5,18.5 270 bottom
C102  12,12.5 90 bottom
C103  19,10.5 0 bottom
C104  21,16 270 bottom
C105  28,17 90 bottom
C106  28,12 90 top
C201  5.5,21.5 270 top
C202  12.5,7.5 180 top
C203  25.5,22.5 270 bottom
C204  12.5,23 270 bottom
C205  31.5,21.5 0 top
C206  28.5,20 0 bottom
C207  18.5,22.5 180 top
D101  17.5,35.5 0 top
F201  3,11 90 top
J201  17.5,4 180 bottom
J202  17.5,30.5 180 bottom
L201  16.5,7.5 180 top
L202  24,22.5 0 top
Q201  19,24.5 90 bottom
R101  17.5,8 180 bottom
R102  17,13.5 90 bottom
R103  28,17 90 top
R104  19,14.5 270 bottom
R105  17.5,35.5 270 bottom
R106  21,34.5 180 bottom
R107  14,35 0 bottom
R201  28.5,23.5 270 top
R202  30,30.5 90 top
U101  17.5,15 180 top
U102  25,17 270 top
U201  23.5,23 90 bottom
U202  14.5,23 90 bottom
U203  31.5,25 90 top
U204  28.5,23.5 270 bottom
Y101  25,12 90 top
Z201  21,8 0 bottom
Z202  25.5,8 180 bottom
Z203  23,26 0 bottom
Z204  15,26 180 bottom

### Tracks (layer width: path | path; a pad name or v marks a point on that pad's centre or on a via)
+3V3  (via drill 0.3)  (8 unrouted)
  Top 0.254: v30.65,20.6 C205.1 30.65,22.33 arc45 30.6,22.45 arc-45 30.55,22.57 U203.1 | U102.5 26.37,15.7 arc45 26.85,15.9 arc-45 27.45,16.15 C105.1 | Y101.P4 Y101.P1 26.66,10.9 arc45 26.9,11 arc-45 27.26,11.15 C106.1 v28.9,11.15 | U101.1 v22.75,12.25 | U101.9 22.54,16.25 arc45 22.9,16.4 v23.35,16.85 | U101.48 v20.25,11.75 | D101.4 v15.85,35.95 | U101.18 U101.17 v18.25,18.1 15.2,18.1 arc-90 14.75,18.55 U101.24 | v14.85,12.1 arc45 14.49,12.25 U101.36
  Top 0.61: L201.2 C202.1 v13.35,8.65 | C105.1 v28,15.2
  Route15 0.254: 17.45,35.95 17.45,34.94 arc45 18.15,33.25 arc-45 18.8,31.68 18.8,21.45 arc45 18.84,21.36 v23.35,16.85
  Route15 0.61: v13.35,8.65 16.7,8.65 16.7,10.5 | 16.7,10.5 20.25,10.5 v20.25,11.75 | 16.7,10.5 16.7,10.75 arc90 15.35,12.1 v14.85,12.1 | v15.85,35.95 17.45,35.95
  Bottom 0.254: C204.1 arc-45 12.59,23.82 13.03,23.37 arc45 13.8,23.05 14.5,23.05 | U201.5 23.5,23.25 arc90 23.75,23 24.14,23 arc45 24.5,23.15 arc-45 24.98,23.35 C203.1 26.23,22.62 arc-45 26.45,22.09 v26.45,19.75 | C206.1 28.85,20.5 arc-45 28.5,21.35 28.5,22.43 arc45 28.2,23.15 27.83,23.52 arc-45 27.55,24.2 U204.1 | U202.5 14.5,23.05 | 14.5,23.05 16.38,23.05 arc45 v16.5,23
  Bottom 0.61: v23.35,16.85 C104.1 | v30.65,20.6 30.65,20.4 arc-90 30.25,20 C206.1 | v18.25,18.1 arc90 17,19.35 C101.1 | v28,15.2 C105.1 | v14.85,12.1 arc-45 13.76,11.65 C102.1 | v20.25,11.75 20.25,11.47 arc-45 C103.1
  pour Route15: 14,-1 36,-1 36,31 28,39 16.8,39 16.8,24.25 16,23.45 16,22 16.8,21.2 16.8,16.8 14,14
+3V3_
  Top 0.61: L201.1 17.91,7.5 arc-45 18.41,7.29 arc-45 18.55,6.95 18.55,6.55 arc-45 18.39,6.16 J201.11
BOOT0  (via drill 0.3)
  Top 0.254: U101.44 18.25,9.71 arc-45 v18.1,9.35
  Bottom 0.254: v18.1,9.35 arc-45 18.35,8.75 R101.2
ENABLE_CHARGE_CON
  Bottom 0.254: J202.10 16.76,28.49 arc-45 15.45,27.95 14.85,27.95 arc90 14,27.1 Z204.6 Z204.5 14,24.5 | 14,24.5 U202.4 | U202.6 15,24.25 arc90 14.75,24.5 14,24.5
ENABLE_CHARGE_STM  (via drill 0.3)
  Top 0.254: U101.31 14.5,14.75 arc-45 v15.07,14.52
  Route15 0.254: v15.07,14.52 arc45 15.95,14.15 16.5,14.15 arc90 17.65,15.3 arc45 17.44,15.81 16.99,16.26 arc-45 16.25,18.05 v16.25,20.65
  Bottom 0.254: U202.3 14,21.96 arc-45 13.85,21.6 13.84,21.59 arc45 13.7,21.25 13.7,21.2 arc90 14.25,20.65 15.4,20.65 | U202.1 15,21.84 arc45 15.17,21.43 15.2,21.4 arc-45 15.4,20.92 15.4,20.65 | 15.4,20.65 v16.25,20.65
ENABLE_DISCHARGE_CON
  Bottom 0.254: J202.12 21.6,27.67 arc-45 22,26.7 Z203.1 Z203.10 22,25.15 arc-90 21.35,24.5 Q201.3
ENABLE_DISCHARGE_STM  (via drill 0.3)
  Top 0.254: v14.4,13.9 14.12,14.18 arc45 13.95,14.25 U101.32
  Route15 0.254: v17.7,24.45 16.8,24.45 arc90 15.8,23.45 15.8,22.5 arc45 16.12,21.73 16.55,21.3 arc-45 16.95,20.33 16.95,18.04 arc45 17.65,16.35 17.69,16.31 arc-45 18.15,15.2 arc-90 16.6,13.65 15,13.65 arc-45 v14.4,13.9
  Bottom 0.254: Q201.1 v17.7,24.45
GND  (via drill 0.3)  (73 unrouted)
  Bottom 0.254: U202.2 v14.5,21.3 | U204.2 v28.5,26.05 | Z203.7 23.5,25.3 arc-45 v23.37,24.99 | Z204.4 Z204.7 14.5,26.95 15,26.95 Z204.8 Z204.3 15,25.05 14.5,25.05 Z204.4
  other vias: 6.5,25 7.5,25 8.5,25 9.5,25 9.5,24 8.5,24 7.5,24 6.5,24 6.5,23 7.5,23 8.5,23 9.5,23 19,17 32.5,7.5 31.5,16 13,19.5 20.5,26 20.5,21.5 18,21 22,19.5 25,19.5 32,19.5 29.5,17 32.5,12 28,7.5 31.55,25.1
  pour Route2 (no thermals): 8.8,0 8.8,7 13.6,7 13.6,0
  pour Top (rank 6): -1,-1 36,-1 36,30 27.5,38.5 7.5,38.5 -1,30
  pour Route2 (rank 6, no thermals): -1,-1 36,-1 36,30 27.5,38.5 7.5,38.5 -1,30
  pour Bottom (rank 6): -1,-1 36,-1 36,30 27.5,38.5 7.5,38.5 -1,30
  pour Route2 (no thermals): 8.8,0 8.8,6.6 arc46 7.6,9.45 arc-45 5,15.5 5,23.3 arc-38 5.55,24.9 arc-53 6.5,25.35 9.65,25.35 arc-90 11.4,23.6 11.4,15 arc31 12.5,11 arc-31 13.6,7 13.6,0
  pour Route2 (no thermals): 15.5,33 12,33 arc90 11.5,32.5 11.5,29 arc-90 10,27.5 9.5,27.5 arc64 5.5,25 arc27 5.24,23.86 arc90 7.1,22 10,22 arc90 16,28 16,32.5 arc90
  pour Top (no thermals): 8.5,1.5 31.5,1.5 31.5,6.5 8.5,6.5
  pour Bottom (no thermals): 8.5,1.5 13.5,1.5 13.5,6.5 8.5,6.5
  pour Top (no thermals): 6,20 11,20 11,23 6,23
  pour Top (rank 6, no thermals): 11,28 16,28 16,33 11,33
  pour Route15 (rank 6, no thermals): -1,-1 14,-1 14,14 arc90 12.95,15.05 12.5,15.05 arc-90 11.25,16.3 11.25,17.25 arc-90 12.2,18.2 16.8,18.2 16.8,39 7,39 -1,31
HEARTBEAT_BLUE  (via drill 0.3)
  Top 0.254: U101.45 18.75,12.26 arc-45 v18.85,12.5
  Route2 0.254: v33.05,13.65 21.05,13.65 arc45 19.26,12.91 v18.85,12.5
  Route15 0.254: v33.05,13.65 33.05,27.2 arc45 32.31,28.99 28.25,33.05 arc45 27.16,33.5 v19.32,33.5 arc-45 v19.31,33.51
  Bottom 0.254: R107.2 13.15,34.3 arc90 13.95,33.5 v19.3,33.5 arc90 v19.31,33.51
HEARTBEAT_GREEN  (via drill 0.3)
  Top 0.254: U101.43 17.75,11.25 arc-45 v18,11.85
  Route2 0.254: v18,11.85 18.95,11.85 arc45 19.63,12.13 20,12.5 arc-45 21.21,13 v34.45,13
  Route15 0.254: v34.45,13 34.45,27.25 arc45 33.71,29.04 28.79,33.96 arc45 27,34.7 v23.15,34.7
  Bottom 0.254: R106.2 22.67,34.5 arc45 v23.15,34.7
HEARTBEAT_RED  (via drill 0.3)
  Top 0.254: U101.42 17.25,11.7 arc-45 17.46,12.21 v18,12.75
  Route2 0.254: v18,12.75 18.76,13.51 arc-45 20.67,14.3 v33.8,14.3
  Route15 0.254: v33.8,14.3 33.8,27.2 arc45 33.06,28.99 28.6,33.45 arc45 27.27,34 20.37,34 arc-45 20.25,34.05 20.13,34.16 arc45 19.98,34.23 v18.47,34.23
  Bottom 0.254: R105.2 arc90 17.92,34.23 v18.47,34.23
IR_FEEDBACK_CON  (via drill 0.3)
  Route15 0.254: v16.1,24.95 15.76,24.61 arc45 15.3,23.5 15.3,18.05 arc45 16.04,16.26 v17,15.3
  Bottom 0.254: J202.11 19.54,31.27 arc45 18.8,29.48 18.8,29.1 arc-45 18.38,28.08 18.34,28.04 arc-45 17.03,27.5 16.5,27.5 arc90 16,27 Z204.10 Z204.1 16,25.19 arc45 v16.1,24.95 | v17,15.3 R102.2
IR_FEEDBACK_STM  (via drill 0.3)
  Top 0.254: v16,12.95 16.43,12.52 arc-45 16.75,11.75 U101.41
  Bottom 0.254: v16,12.95 16.19,12.76 arc45 16.45,12.65 R102.1 17.79,13.44 arc-45 18.3,13.65 R104.2
JTCK  (via drill 0.3)
  Top 0.254: U101.37 v14.05,10.75
  Route2 0.254: v22.15,9 22.3,9.15 arc45 22.55,9.75 arc45 22.27,10.43 22.1,10.6 arc45 21.13,11 14.65,11 arc45 v14.05,10.75
  Bottom 0.254: J201.15 arc-45 22,6.67 Z201.6 Z201.5 22,8.64 arc-45 v22.15,9
JTDI  (via drill 0.3)
  Top 0.254: U101.38 15.25,10.06 arc-45 v15.1,9.7
  Route2 0.254: v15.1,9.7 15.9,10.5 20.05,10.5 arc-45 v21.84,9.76 | v21.84,9.76
  Bottom 0.254: J201.14 20.71,3.4 arc45 21.35,4.95 21.35,5.81 arc-45 21.45,6.05 arc45 21.5,6.17 Z201.7 Z201.4 21.5,8.92 arc-45 v21.84,9.76
JTDO  (via drill 0.3)
  Top 0.254: U101.39 15.75,9.8 arc45 v15.89,9.46
  Route2 0.254: v15.89,9.46 16.43,10 19.29,10 arc-45 v20.47,9.51
  Bottom 0.254: J201.13 arc45 20.5,6.38 Z201.9 Z201.2 20.5,9.44 arc45 v20.47,9.51
JTMS  (via drill 0.3)
  Top 0.254: U101.34 14.44,13.25 arc-45 v15.15,12.96
  Route2 0.254: v19.85,9 arc-45 18.64,8.5 15.5,8.5 arc-90 13.4,10.6 13.4,11.8 arc-90 14.55,12.96 v15.15,12.96
  Bottom 0.254: J201.12 18.28,3.51 arc45 18.75,4.65 18.75,5.21 arc-45 19.2,6.3 19.89,6.99 arc45 20,7.25 Z201.10 Z201.1 20,8.64 arc45 v19.85,9
KICK_CHIP_CON
  Bottom 0.254: U201.6 Z203.6 Z203.5 24,26.76 arc45 23.26,28.55 J202.14
KICK_CHIP_STM  (via drill 0.3)
  Top 0.254: U101.30 14.79,15.25 arc-45 v15.86,14.81
  Route2 0.254: v24,21.15 24,20.7 arc-45 23.26,18.91 19.74,15.39 arc-45 17.95,14.65 16.23,14.65 arc-45 v15.86,14.81
  Bottom 0.254: U201.1 v24,21.15
KICK_LINEAR_CON
  Bottom 0.254: J202.13 22.04,31.23 arc45 21.3,29.44 21.3,29.2 arc45 21.65,28.35 21.8,28.2 arc-45 22.5,26.51 Z203.2 Z203.9 22.5,24.94 arc45 22.6,24.7 22.9,24.4 arc-45 23,24.16 U201.4
KICK_LINEAR_STM  (via drill 0.3)
  Top 0.254: U101.29 15.43,15.75 arc45 v15.47,15.77
  Route2 0.254: v22.65,21.15 22.65,19.66 arc-45 22.26,18.71 20.24,16.69 arc-45 18.45,15.95 15.92,15.95 arc45 v15.47,15.77
  Bottom 0.254: U201.3 23,22 arc-45 v22.65,21.15
MISO  (via drill 0.3)
  Top 0.254: U101.27 v11.9,16.75
  Route2 0.254: v24.78,9.7 arc-45 25,9.17 25,8 arc-90 23.5,6.5 12.84,6.5 arc-90 11.15,8.19 11.15,14.95 arc-45 v11.89,16.74 v11.9,16.75
  Bottom 0.254: J201.17 arc-45 25,5.56 Z202.4 Z202.7 25,9.17 arc45 v24.78,9.7
MOSI  (via drill 0.3)
  Top 0.254: v12.15,15.95 12.34,16.14 arc-45 12.6,16.25 U101.28
  Route2 0.254: v24.35,9 24.35,7.95 arc-90 23.4,7 12.99,7 arc-90 11.65,8.34 11.65,13.17 arc-45 11.85,13.65 11.93,13.73 arc45 12.15,14.26 v12.15,15.95
  Bottom 0.254: J201.18 24.59,3.26 arc-45 23.85,5.05 23.85,5.46 arc-45 24.2,6.3 arc45 24.5,7.02 Z202.5 Z202.6 24.5,8.64 arc45 v24.35,9
N$1
  Top 0.254: U203.5 30.55,25.35 arc-90 30.2,25 30.07,25 arc45 R201.1
N$2
  Top 0.254: R201.2 27.52,22.65 arc45 27.4,22.6 arc-45 27.16,22.5 L202.2
N$10  (via drill 0.3)
  Top 0.254: D101.1 v19.1,35.95
  Bottom 0.254: v19.1,35.95 arc90 18.7,36.35 R105.1
N$21  (via drill 0.3)
  Top 0.254: D101.2 v19.1,35.05
  Bottom 0.254: v19.1,35.05 19.1,34.85 arc90 19.45,34.5 R106.1
N$23  (via drill 0.3)
  Top 0.254: D101.3 v15.85,35.05
  Bottom 0.254: v15.85,35.05 arc-45 15.73,35 R107.1
NCS  (via drill 0.3)
  Top 0.254: U101.25 14.25,17.75 arc-90 14.5,17.5 v14.5,17.2
  Route2 0.254: v14.5,17.2 14.5,15.45 arc-45 14.15,14.6 13.44,13.89 arc45 12.65,11.98 12.65,8.5 arc90 13.15,8 22.8,8 arc90 23.2,8.4 23.2,9.6 arc-90 24.45,10.85 25.15,10.85 arc-90 v26.35,9.65
  Bottom 0.254: J201.20 27.14,3.25 arc-45 26.4,5.04 26.4,5.69 arc45 26.25,6.05 arc-45 26,6.65 Z202.2 Z202.9 26,8.95 arc-45 26.25,9.55 v26.35,9.65
NRST
  Top 0.254: U102.4 23.58,15.7 arc45 23.1,15.5 arc-45 22.5,15.25 U101.7
NRST_  (via drill 0.3)
  Top 0.254: v24.9,17.35 arc90 25,17.45 U102.2 U102.1 26.45,18.3 arc-45 26.88,18.12 27,18 arc45 27.36,17.85 R103.2
  Route15 0.254: J201.16 23.11,3.26 arc45 23.85,5.05 23.85,8.26 arc45 23.75,8.5 arc-45 23.6,8.86 23.6,14.21 arc-45 v24.9,17.35
OSC_IN
  Top 0.254: Y101.P3 24.2,13.95 arc90 23.9,14.25 U101.5
SCK  (via drill 0.3)
  Top 0.254: U101.26 12.55,17.25 arc-45 12.29,17.36 v12.1,17.55
  Route2 0.254: v27.15,9 26.15,9 arc-90 25.45,9.7 arc90 24.8,10.35 24.55,10.35 arc90 23.7,9.5 23.7,8 arc-90 23.2,7.5 13.05,7.5 arc-90 12.15,8.4 12.15,12.5 arc-45 12.75,13.95 arc45 13.2,15.04 13.2,16.15 arc45 12.99,16.66 v12.1,17.55
  Bottom 0.254: J201.19 27.24,5.69 arc-45 26.5,7.48 Z202.1 Z202.10 26.5,8.75 arc-90 26.75,9 v27.15,9
VCC  (5 unrouted)
  pour Top (no thermals): 0,12 4,12 arc90 5,13 5,23.5 arc-90 9.5,28 arc90 11,29.5 11,31.5 arc90 9.5,33 3,33 arc90 0,30
VCC_  (4 unrouted)
  pour Top (no thermals): 0,0 0,10 5,10 arc-90 8.3,6.7 8.3,0
VOLTAGE_DATA_CON_N
  Top 0.152: J202.18 28.54,29.23 arc45 28.95,29.4 arc-45 29.55,29.65 R202.1 31.8,29.65 arc-90 32.45,29 U203.4
VOLTAGE_DATA_CON_P
  Top 0.152: J202.17 28.59,31.77 arc-45 29,31.6 arc45 29.6,31.35 R202.2 31.9,31.35 arc-90 33.15,30.1 33.15,26 arc-45 32.76,25.06 32.7,25 arc45 32.45,24.4 U203.3
VOLTAGE_DATA_STM
  Top 0.254: L202.1 C207.1 19.35,21.6 arc-45 19.1,21 arc45 18.75,20.16 U101.16
VOLTAGE_SCK_CON_N
  Bottom 0.254: U204.3 29.45,25.6 arc90 28.1,26.95 26.5,26.95 arc-45 24.71,27.69 24.35,28.05 arc-45 23.85,29.26 23.85,29.45 arc-45 24.59,31.24 J202.15
VOLTAGE_SCK_CON_P
  Bottom 0.254: U204.4 29.45,22.97 arc-45 29.72,23.62 30.2,24.1 arc45 30.55,24.95 30.55,26.3 arc45 30.13,27.32 30.1,27.35 arc45 29.26,27.7 27.35,27.7 arc-45 26.16,28.19 J202.16
VOLTAGE_SCK_STM  (via drill 0.3)
  Top 0.254: U101.13 20.25,19.85 arc-90 20.75,20.35 25.6,20.35 arc45 27.39,21.09 v27.55,21.25
  Bottom 0.254: v27.55,21.25 U204.5

### Text on the board
tPlace: VCC | PGND | BEAM | LIN | SCK- | DAT+ | CHRG | DISCH | CHIP | SCK+ | DAT- | JTDO | JTCK | MISO | SCK | VCC | VCC | 5V | JTMS | JTDI | NRST | MOSI | NCS | GND | Pasta Kicker Controller 04